# EAGLE schematic styrenhet (EAGLE 6.4)
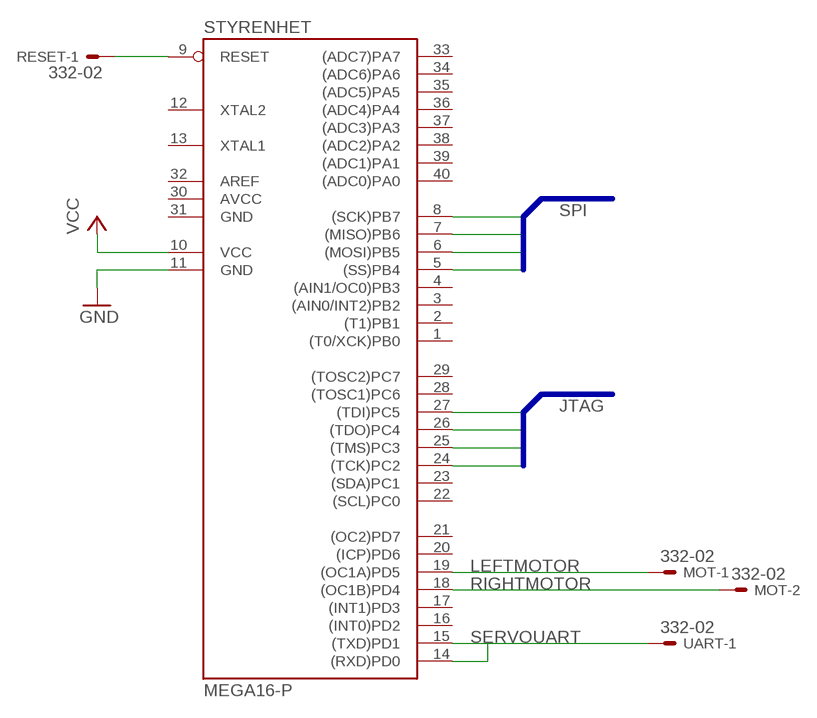
[diagram p0: schematic, sheet 1]

## Parts
MOT  332-02  [332-02]
RESET  332-02  [332-02]
STYRENHET  MEGA16-P  [DIL40]
UART  332-02  [332-02]

## Nets
GND: STYRENHET.11(GND)
LEFTMOTOR: MOT.1 STYRENHET.19((OC1A)PD5)
N$1: RESET.1 STYRENHET.9(RESET)
N$2: STYRENHET.24((TCK)PC2)
N$3: STYRENHET.25((TMS)PC3)
N$4: STYRENHET.26((TDO)PC4)
N$5: STYRENHET.27((TDI)PC5)
N$6: STYRENHET.5((SS)PB4)
N$7: STYRENHET.6((MOSI)PB5)
N$8: STYRENHET.7((MISO)PB6)
N$9: STYRENHET.8((SCK)PB7)
RIGHTMOTOR: STYRENHET.18((OC1B)PD4)
SERVOUART: STYRENHET.14((RXD)PD0) STYRENHET.15((TXD)PD1) UART.1
VCC: STYRENHET.10(VCC)
Unconnected: MOT.2 RESET.2 STYRENHET.1((T0/XCK)PB0) STYRENHET.2((T1)PB1) STYRENHET.3((AIN0/INT2)PB2) STYRENHET.4((AIN1/OC0)PB3) STYRENHET.12(XTAL2) STYRENHET.13(XTAL1) STYRENHET.16((INT0)PD2) STYRENHET.17((INT1)PD3) STYRENHET.20((ICP)PD6) STYRENHET.21((OC2)PD7) STYRENHET.22((SCL)PC0) STYRENHET.23((SDA)PC1) STYRENHET.28((TOSC1)PC6) STYRENHET.29((TOSC2)PC7) STYRENHET.32(AREF) STYRENHET.33((ADC7)PA7) STYRENHET.34((ADC6)PA6) STYRENHET.35((ADC5)PA5) STYRENHET.36((ADC4)PA4) STYRENHET.37((ADC3)PA3) STYRENHET.38((ADC2)PA2) STYRENHET.39((ADC1)PA1) STYRENHET.40((ADC0)PA0) UART.2

## Buses
SPI
JTAG

## Power pins joined to a net without a drawn wire
AVCC: STYRENHET.30(AVCC)
GND: STYRENHET.31(GND)

## Library data of the parts
MOT RESET UART = con-garry:332-02: 2 Pin - 2mm Dual Row Source: www.mpe-connector.de / garry_shortform_2012.pdf
STYRENHET = atmel:MEGA16-P: MICROCONTROLLER 16 Kbytes FLASH 1 kbytes SRAM 512 bytes EEPROM USART 8-channel 10 bit ADC Source: avr.lbr; MPN: ATMEGA16-16PU; OC_FARNELL: 9171142; OC_NEWARK: 01M6885